# Altium schematic sheet projet_pcb_naked_g431.SchDoc
size A2
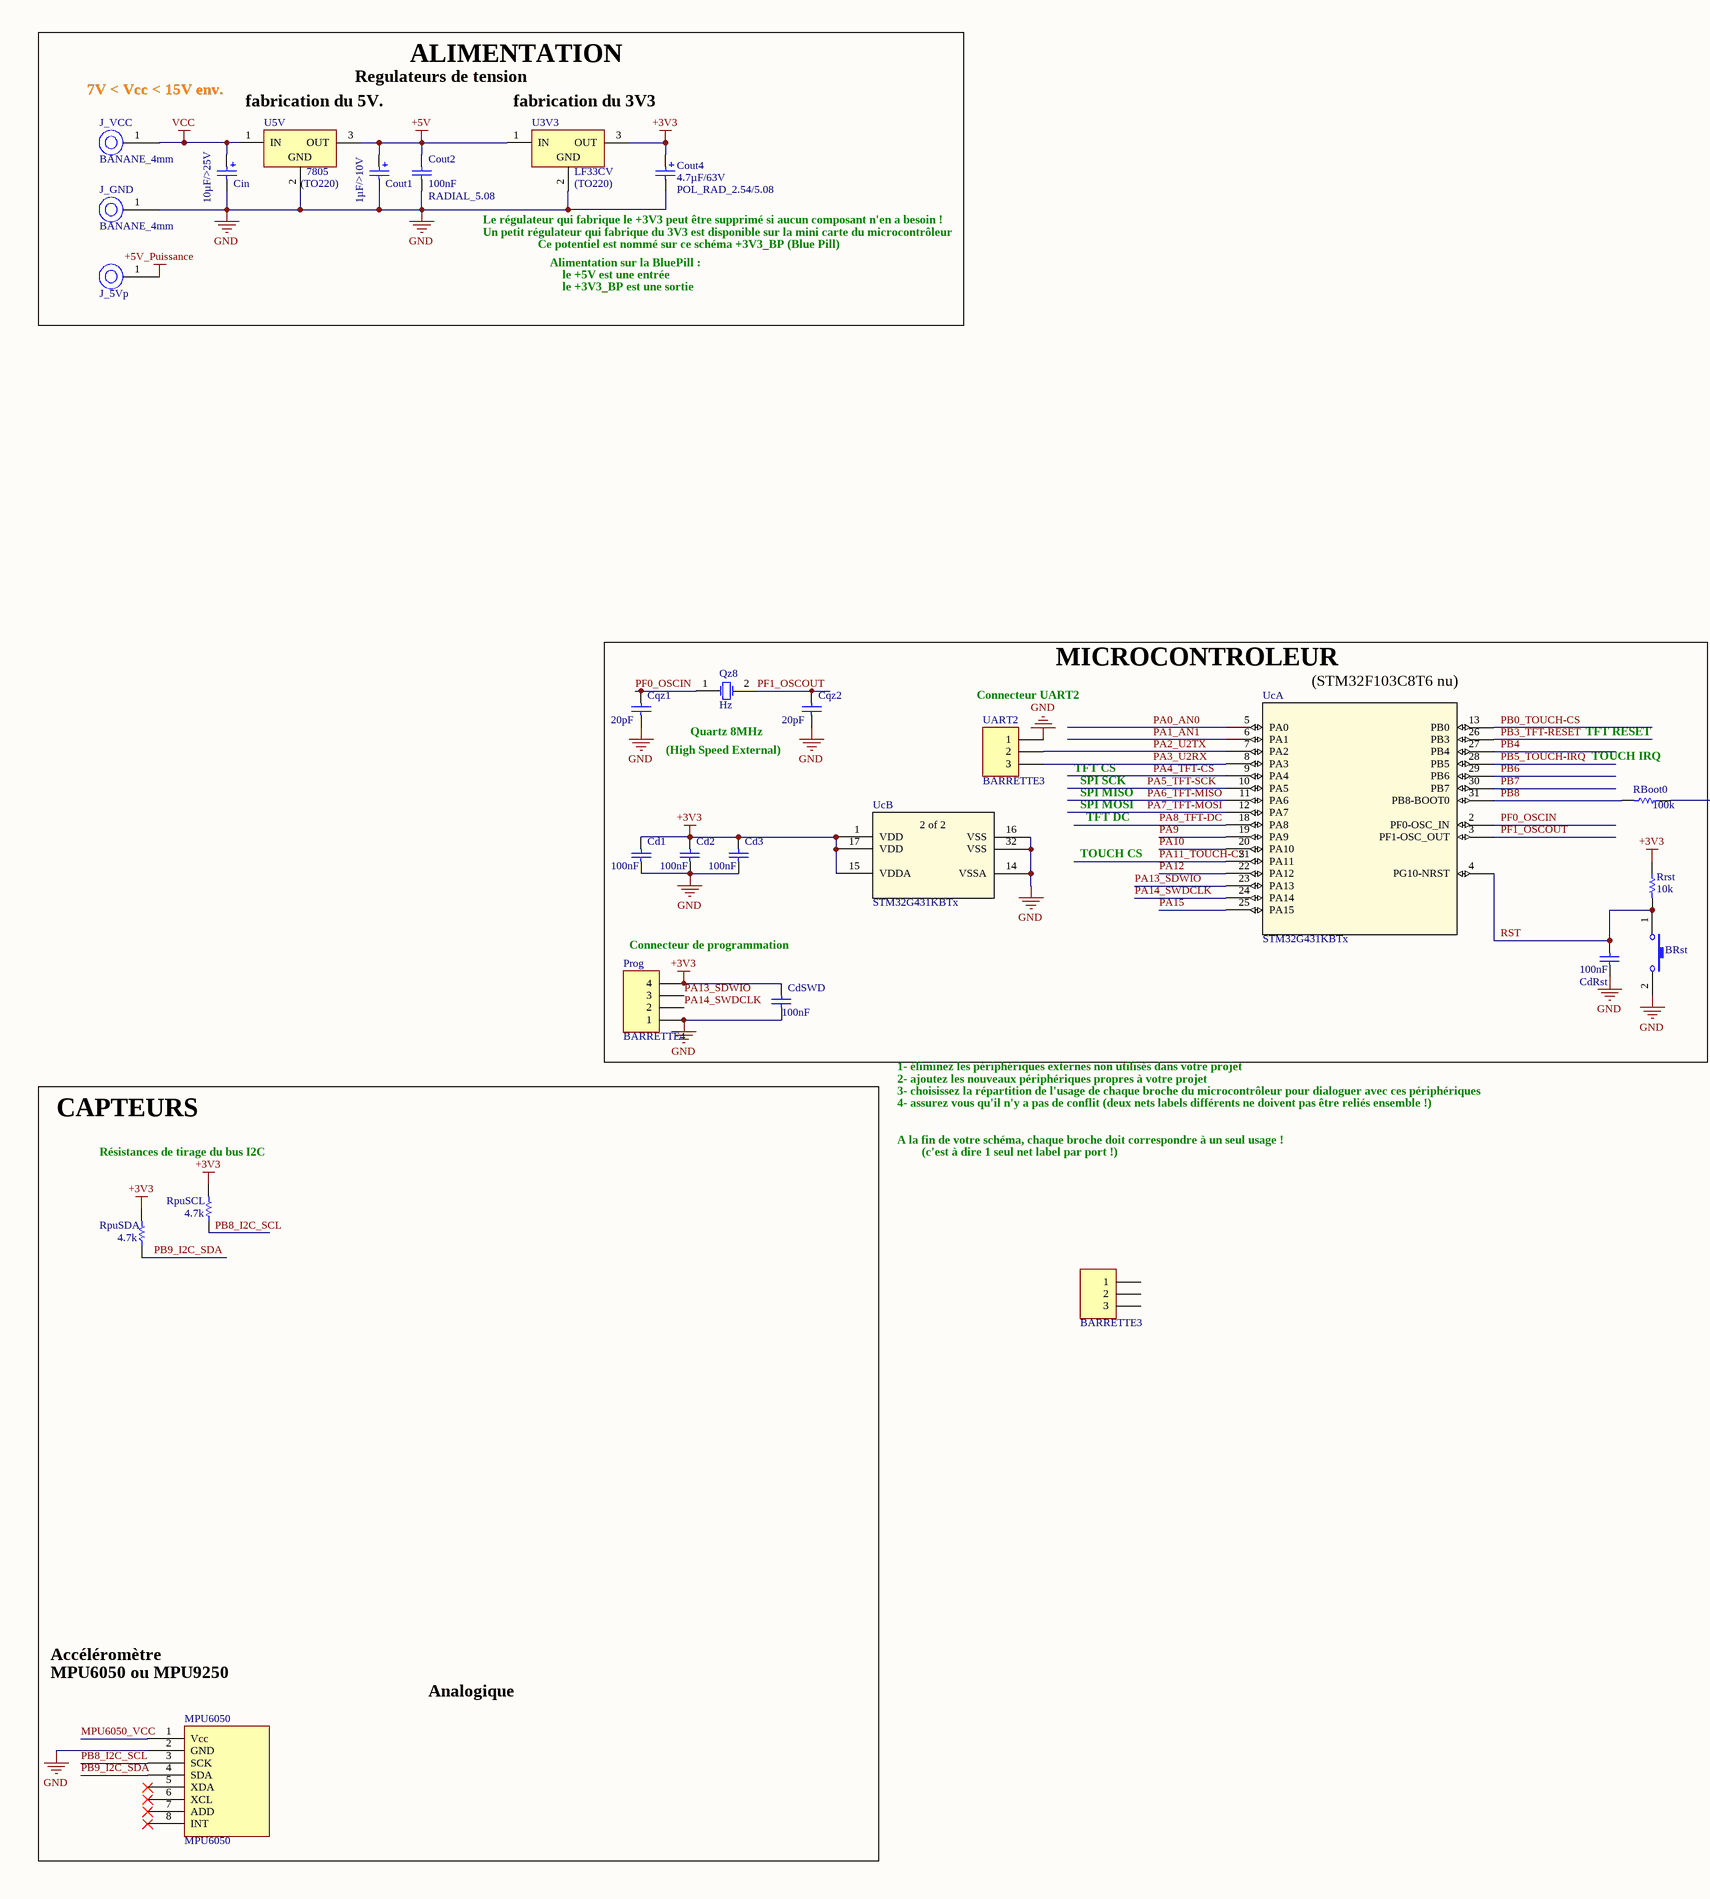
[diagram p0: projet_pcb_naked_g431.SchDoc, left]
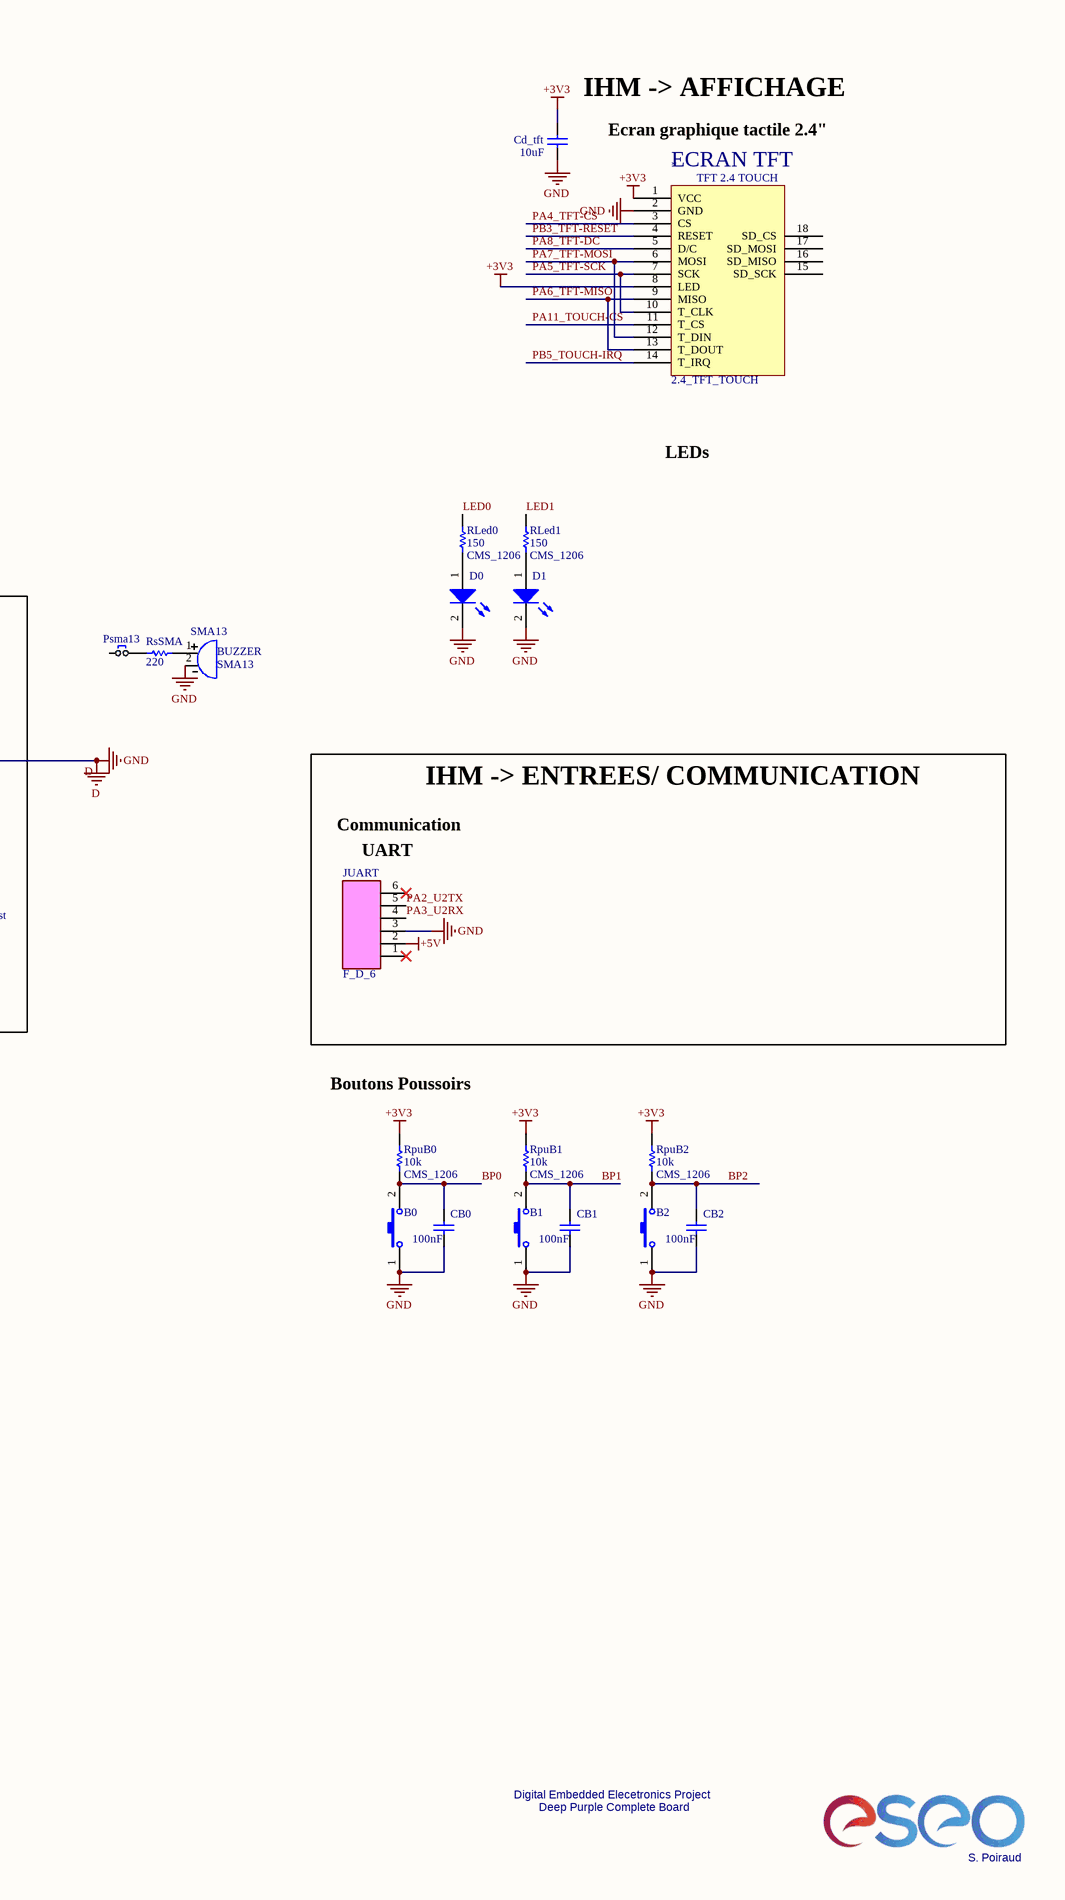
[diagram p1: projet_pcb_naked_g431.SchDoc, right]

## Parts
*  2.4_TFT_TOUCH  [2.4_TFT_TOUCH]
?  BARRETTE3  [HDR1X3]
B0  BOUTON_POUSSOIR_MINIATURE_TRAVERSANT  [BOUTON_POUSSE_PLAT_6x6]  (value not drawn)
B1  BOUTON_POUSSOIR_MINIATURE_TRAVERSANT  [BOUTON_POUSSE_PLAT_6x6]  (value not drawn)
B2  BOUTON_POUSSOIR_MINIATURE_TRAVERSANT  [BOUTON_POUSSE_PLAT_6x6]  (value not drawn)
BRst  BOUTON_POUSSOIR_MINIATURE_TRAVERSANT  [BOUTON_POUSSE_PLAT_6x6]  (value not drawn)
CB0  value 100nF  [C0805_N]  (hidden comment: Condensateur 0805)
CB1  value 100nF  [C0805_N]  (hidden comment: Condensateur 0805)
CB2  value 100nF  [C0805_N]  (hidden comment: Condensateur 0805)
Cd1  value 100nF  [C0805_N]  (hidden comment: Condensateur 0805)
Cd2  value 100nF  [C0805_N]  (hidden comment: Condensateur 0805)
Cd3  value 100nF  [C0805_N]  (hidden comment: Condensateur 0805)
Cd_tft  10uF  [CONDENSATEUR_POLARISE_ELECTROLYTIQUE_RADIAL_2.54/5.08]
CdRst  value 100nF  [C0805_N]  (hidden comment: Condensateur 0805)
CdSWD  value 100nF  [C0805_N]  (hidden comment: Condensateur 0805)
Cin  value 10µF/>25V  [CONDENSATEUR_POLARISE_ELECTROLYTIQUE_RADIAL_2.0/5.08]  (hidden comment: CONDENSATEUR_POL_ELECTROLY_RAD_2.0/5.08)
Cout1  value 1µF/>10V  [CONDENSATEUR_POLARISE_ELECTROLYTIQUE_RADIAL_2.0/5.08]  (hidden comment: CONDENSATEUR_POL_ELECTROLY_RAD_2.0/5.08)
Cout2  value 100nF  Type: RADIAL_5.08  [CONDENSATEUR_CERAMIQUE_RADIAL_5.08]  (hidden comment: CONDENSATEUR_CER_RAD_5.08)
Cout4  value 4.7µF/63V  Type: POL_RAD_2.54/5.08  [CONDENSATEUR_POLARISE_ELECTROLYTIQUE_RADIAL_2.54/5.08]  (hidden comment: CONDENSATEUR_POL_ELECTROLY_RAD_2.54/5.08)
Cqz1  value 20pF  [C0805_N]  (hidden comment: Condensateur 0805)
Cqz2  value 20pF  [C0805_N]  (hidden comment: Condensateur 0805)
D0  LED_3MM  [LED_3MM]  (value not drawn)
D1  LED_3MM  [LED_3MM]  (value not drawn)
J_5Vp  DOUILLE BANANE 4mm  [DOUILLE_BANANE_4mm]  (value not drawn)
J_GND  Type: BANANE_4mm  [DOUILLE_BANANE_4mm]  (hidden comment: DOUILLE BANANE 4mm)
J_VCC  Type: BANANE_4mm  [DOUILLE_BANANE_4mm]  (hidden comment: DOUILLE BANANE 4mm)
JUART  Type: F_D_6  [BARRETTE_6_F_D]  (hidden comment: BARRETTE_6 CONTACTS_1 RANGEE_FEMELLE_DROITE)
MPU6050  MPU6050  [MPU6050]
Prog  BARRETTE4  [HE14_4]
Psma13  Jumper SIP 2.54  [HDR1X2]  (value not drawn)
Qz8  Hz  [HC49/4H_SMX]
RBoot0  100k  [R1206_N]
RLed0  value 150  Type: CMS_1206  [RESISTANCE_CMS_1206]  (hidden comment: RESISTANCE_CMS_1206)
RLed1  value 150  Type: CMS_1206  [RESISTANCE_CMS_1206]  (hidden comment: RESISTANCE_CMS_1206)
RpuB0  value 10k  Type: CMS_1206  [RESISTANCE_CMS_1206]  (hidden comment: RESISTANCE_CMS_1206)
RpuB1  value 10k  Type: CMS_1206  [RESISTANCE_CMS_1206]  (hidden comment: RESISTANCE_CMS_1206)
RpuB2  value 10k  Type: CMS_1206  [RESISTANCE_CMS_1206]  (hidden comment: RESISTANCE_CMS_1206)
RpuSCL  4.7k  [R1206_N]
RpuSDA  4.7k  [R1206_N]
Rrst  10k  [R1206_N]
RsSMA  220  [R1206_N]
SMA13  value SMA13  Type: BUZZER  [BUZZER_SMA13]  (hidden comment: BUZZER_SMA13)
U3V3  Type: LF33CV  Package: (TO220)  [REGULATEUR_TO220_78XX]  (hidden comment: REGULATEUR_TO220_78XX)
U5V  Type: 7805  Package: (TO220)  [REGULATEUR_TO220_78XX]  (hidden comment: REGULATEUR_TO220_78XX)
UART2  BARRETTE3  [HDR1X3]
Uc  STM32G431KBTx  [LQFP-32]  (parts A,B of 2)

## Blocks framed on the sheet
ALIMENTATION: Cin Cout1 Cout2 Cout4 J_5Vp J_GND J_VCC U3V3 U5V
MICROCONTROLEUR: BRst Cd1-Cd3 CdRst CdSWD Cqz1 Cqz2 Prog Qz8 RBoot0 Rrst UART2 Uc
IHM -> ENTREES/ COMMUNICATION: JUART
CAPTEURS: MPU6050 RpuSCL RpuSDA

## Nets
+3V3: *.1(VCC) *.8(LED) Cd1.2 Cd2.2 Cd3.2 Cd_tft.1 CdSWD.2 Cout4.1 Prog.4 RpuB0.2 RpuB1.2 RpuB2.2 RpuSCL.2 RpuSDA.2 Rrst.1 U3V3.3(OUT) Uc.1(VDD) Uc.15(VDDA) Uc.17(VDD)
+5V: Cout1.1 Cout2.2 JUART.2 U3V3.1(IN) U5V.3(OUT)
+5V_Puissance: J_5Vp.1
D: *.2(GND) B0.1 B1.1 B2.1 BRst.2 CB0.1 CB1.1 CB2.1 Cd1.1 Cd2.1 Cd3.1 Cd_tft.2 CdRst.1 CdSWD.1 Cin.2 Cout1.2 Cout2.1 Cout4.2 Cqz1.1 Cqz2.1 D0.2 D1.2 J_GND.1 JUART.3 MPU6050.2(GND) Prog.1 RBoot0.1 SMA13.2 U3V3.2(GND) U5V.2(GND) UART2.1 Uc.14(VSSA) Uc.16(VSS) Uc.32(VSS)  [also labelled GND]
VCC: Cin.1 J_VCC.1 U5V.1(IN)
BP0: B0.2 CB0.2 RpuB0.1
BP1: B1.2 CB1.2 RpuB1.1
BP2: B2.2 CB2.2 RpuB2.1
LED0: RLed0.2
LED1: RLed1.2
MPU6050_VCC: MPU6050.1(Vcc)
PA0_AN0: Uc.5(PA0)
PA1_AN1: Uc.6(PA1)
PA2_U2TX: JUART.5 UART2.2 Uc.7(PA2)
PA3_U2RX: JUART.4 UART2.3 Uc.8(PA3)
PA4_TFT-CS: *.3(CS) Uc.9(PA4)
PA5_TFT-SCK: *.7(SCK) *.10(T_CLK) Uc.10(PA5)
PA6_TFT-MISO: *.9(MISO) *.13(T_DOUT) Uc.11(PA6)
PA7_TFT-MOSI: *.6(MOSI) *.12(T_DIN) Uc.12(PA7)
PA8_TFT-DC: *.5(D/C) Uc.18(PA8)
PA9: Uc.19(PA9)
PA10: Uc.20(PA10)
PA11_TOUCH-CS: *.11(T_CS) Uc.21(PA11)
PA12: Uc.22(PA12)
PA13_SDWIO: Prog.3 Uc.23(PA13)
PA14_SWDCLK: Prog.2 Uc.24(PA14)
PA15: Uc.25(PA15)
PB0_TOUCH-CS: Uc.13(PB0)
PB3_TFT-RESET: *.4(RESET) Uc.26(PB3)
PB4: Uc.27(PB4)
PB5_TOUCH-IRQ: *.14(T_IRQ) Uc.28(PB5)
PB6: Uc.29(PB6)
PB7: Uc.30(PB7)
PB8: RBoot0.2 Uc.31(PB8-BOOT0)
PB8_I2C_SCL: MPU6050.3(SCK) RpuSCL.1
PB9_I2C_SDA: MPU6050.4(SDA) RpuSDA.1
PF0_OSCIN: Cqz1.2 Qz8.1(OSC1) Uc.2(PF0-OSC_IN)
PF1_OSCOUT: Cqz2.2 Qz8.2(OSC2) Uc.3(PF1-OSC_OUT)
RST: BRst.1 CdRst.2 Rrst.2 Uc.4(PG10-NRST)
NetD0_1: D0.1 RLed0.1
NetD1_1: D1.1 RLed1.1
NetPsma13_2: Psma13.2 RsSMA.2
NetRsSMA_1: RsSMA.1 SMA13.1

Not connected (* = marked no-connect by the designer): * 15(SD_SCK) 16(SD_MISO) 17(SD_MOSI) 18(SD_CS); ? 1 2 3; JUART 1* 6*; MPU6050 5(XDA)* 6(XCL)* 7(ADD)* 8(INT)*; Psma13 1

## Notes on the sheet
- 7V < Vcc < 15V env.
- Regulateurs de tension
- (near U5V) fabrication du 5V.
- (near U3V3) fabrication du 3V3
- Le régulateur qui fabrique le +3V3 peut être supprimé si aucun composant n'en a besoin !
- (near Cd_tft) IHM -> AFFICHAGE
- Ecran graphique tactile 2.4"
- Un petit régulateur qui fabrique du 3V3 est disponible sur la mini carte du microcontrôleur
- Ce potentiel est nommé sur ce schéma +3V3_BP (Blue Pill)
- Alimentation sur la BluePill :
- le +5V est une entrée
- (near *) ECRAN TFT
- le +3V3_BP est une sortie
- LEDs
- (near UART2) Connecteur UART2
- (near Uc) (STM32F103C8T6 nu)
- (High Speed External)
- Quartz 8MHz
- TFT RESET
- (near RBoot0) TOUCH IRQ
- TFT CS
- SPI SCK
- SPI MISO
- SPI MOSI
- TFT DC
- D
- TOUCH CS
- Communication
- Connecteur de programmation
- (near JUART) UART
- 1- éliminez les périphériques externes non utilisés dans votre projet
- 2- ajoutez les nouveaux périphériques propres à votre projet
- 4- assurez vous qu'il n'y a pas de conflit (deux nets labels différents ne doivent pas être reliés ensemble !)
- 3- choisissez la répartition de l'usage de chaque broche du microcontrôleur pour dialoguer avec ces périphériques
- Boutons Poussoirs
- (near RpuSCL) Résistances de tirage du bus I2C
- A la fin de votre schéma, chaque broche doit correspondre à un seul usage !
- (c'est à dire 1 seul net label par port !)
- Accéléromètre
- MPU6050 ou MPU9250
- Analogique
- Digital Embedded Elecetronics Project
- Deep Purple Complete Board
- S. Poiraud
- Title
- Size:
- Date:
- File:
- A2
- Number:
- Time:
- Revision:
- Sheet
- of
- (in symbol 2.4_TFT_TOUCH) TFT 2.4 TOUCH
- (in symbol STM32G431KBTx, part B) 2 of 2

## Library data of the parts
? UART2 = BARRETTE3: Header, 3-Pin; LatestRevisionDate: 17-Jul-2002; LatestRevisionNote: Re-released for DXP Platform.; Publisher: Altium Limited
B0-B2 BRst = BOUTON_POUSSOIR_MINIATURE_TRAVERSANT: BOUTON POUSSOIR MINIATURE TRAVERSANT ON/OFF; Type: B_POUSS_MINI_T
CB0-CB2 Cd1-Cd3 CdRst CdSWD Cqz1 Cqz2 = CONDENSATEUR_CER_RAD_5.08: Type: RADIAL_5.08
Cd_tft = Condensateur: Capacitor; Published: 8-Jun-2000; LatestRevisionDate: 17-Jul-2002; LatestRevisionNote: Re-released for DXP Platform.; PackageReference: RAD-0.3; Publisher: Altium Limited
Cin Cout1 = CONDENSATEUR_POL_ELECTROLY_RAD_2.0/5.08: CONDENSATEUR POLARISE ELECTROLYTIQUE RADIAL 2.0/5.08; Type: POL_RAD_2.0/5.08
Cout2 = CONDENSATEUR_CER_RAD_5.08: CONDENSATEUR TRAVERSANT CERAMIQUE RADIAL 5.08mm
Cout4 = CONDENSATEUR_POL_ELECTROLY_RAD_2.54/5.08: CONDENSATEUR POLARISE ELECTROLYTIQUE RADIAL 2.54/5.08
D0 D1 = LED_3MM: LED 3MM - ROUGE/VERTE/JAUNE; Type: LED_3mm
J_5Vp J_GND J_VCC = DOUILLE_BANANE_4mm: DOUILLE BANANE 4 mm
  J_5Vp: Type: BANANE_4mm
JUART = BARRETTE_6 CONTACTS_1 RANGEE_FEMELLE_DROITE: BARRETTE 6 CONTACTS 1 RANGEE FEMELLE DROITE
Prog = BARRETTE4: Header, 4-Pin; LatestRevisionDate: 17-Jul-2002; LatestRevisionNote: Re-released for DXP Platform.; Publisher: Altium Limited
Psma13 = Jumper SIP2.54
Qz8 = Quartz: Crystal Oscillator; Published: 8-Jun-2000; LatestRevisionDate: 17-Jul-2002; LatestRevisionNote: Re-released for DXP Platform.; PackageReference: R38; Publisher: Altium Limited
RBoot0 RpuSCL RpuSDA Rrst RsSMA = Resistor: Published: 8-Jun-2000; LatestRevisionDate: 17-Jul-2002; LatestRevisionNote: Re-released for DXP Platform.; PackageReference: AXIAL-0.5; Publisher: Altium Limited
RLed0 RLed1 RpuB0-RpuB2 = RESISTANCE_CMS_1206: RESISTANCE CMS 1206
SMA13 = BUZZER_SMA13: BUZZER SMA13
U3V3 U5V = REGULATEUR_TO220_78XX: REGULATEUR DE TENSION POSITIVE 78XX BOITIER TO220
Uc = STM32G431KBTx: Mainstream Arm Cortex-M4 core with DSP and FPU, 170MHz with 128Kbytes of Flash memory, Math Accelerator, Medium Analog level integration; Manufacturer_Part_Number: stm32g4_lqfp32_t1; Built_By: EMA_Jessica; Vendor: STMicroelectronics; Copyright: Copyright (C) 2016 Accelerated Designs. All rights reserved; RefDes: RefDes; Type: DEV; Value: Value